# EAGLE design olhos (EAGLE 9.6.2)
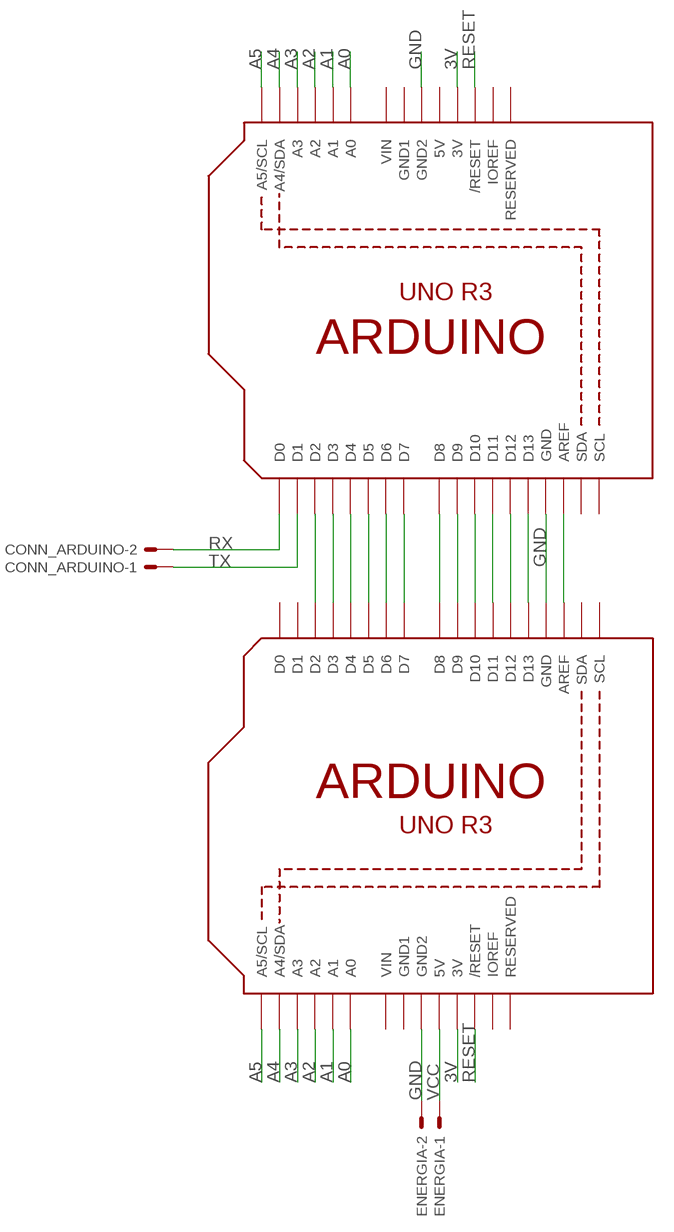
[diagram p0: schematic, sheet 1]

## Parts
CONN_ARDUINO  22-23-2021  [22-23-2021]
ENERGIA  22-23-2021  [22-23-2021]
TELA_LCD  ARDUINOR3-BPLACE  [ARDUINOR3-BPLACE]
U2  ARDUINOR3-BPLACE  [ARDUINOR3-BPLACE]

## Nets
3V [ENERGIA]: TELA_LCD.3V U2.3V
A0: TELA_LCD.A0 U2.A0
A1: TELA_LCD.A1 U2.A1
A2: TELA_LCD.A2 U2.A2
A3: TELA_LCD.A3 U2.A3
A4: TELA_LCD.A4(A4/SDA) U2.A4(A4/SDA)
A5: TELA_LCD.A5(A5/SCL) U2.A5(A5/SCL)
GND [ENERGIA]: ENERGIA.2 TELA_LCD.GND TELA_LCD.GND2 U2.GND U2.GND2
N$1: TELA_LCD.D2 U2.D2
N$2: TELA_LCD.D3 U2.D3
N$3: TELA_LCD.D4 U2.D4
N$4: TELA_LCD.D5 U2.D5
N$5: TELA_LCD.D6 U2.D6
N$6: TELA_LCD.D7 U2.D7
N$7: TELA_LCD.D8 U2.D8
N$8: TELA_LCD.D9 U2.D9
N$9: TELA_LCD.D10 U2.D10
N$10: TELA_LCD.D11 U2.D11
N$11: TELA_LCD.D12 U2.D12
N$12: TELA_LCD.D13 U2.D13
N$14: TELA_LCD.AREF U2.AREF
RESET: TELA_LCD.RESET(/RESET) U2.RESET(/RESET)
RX: CONN_ARDUINO.2 U2.D0
TX: CONN_ARDUINO.1 U2.D1
VCC [ENERGIA]: ENERGIA.1 TELA_LCD.5V
Unconnected: TELA_LCD.D0 TELA_LCD.D1 TELA_LCD.IOREF TELA_LCD.RESERVED TELA_LCD.SCL TELA_LCD.SDA U2.IOREF U2.RESERVED U2.SCL U2.SDA

## Power pins joined to a net without a drawn wire
5V: U2.5V
GND1: TELA_LCD.GND1 U2.GND1
VIN: TELA_LCD.VIN U2.VIN

## Library data of the parts
CONN_ARDUINO ENERGIA = con-molex:22-23-2021: .100" (2.54mm) Center Header - 2 Pin; MF: MOLEX; MPN: 22-23-2021; OC_FARNELL: 1462926; OC_NEWARK: 25C3832
TELA_LCD U2 = adafruit:ARDUINOR3: This is a new object for the new Arduino R3 - with extra pins that you may want to use (such as IOref, and duplicated A4/A5

## Net classes
0 default: width 0.508 mm, clearance 0.5 mm
1 ENERGIA: width 1.016 mm, clearance 0.5 mm

## Board
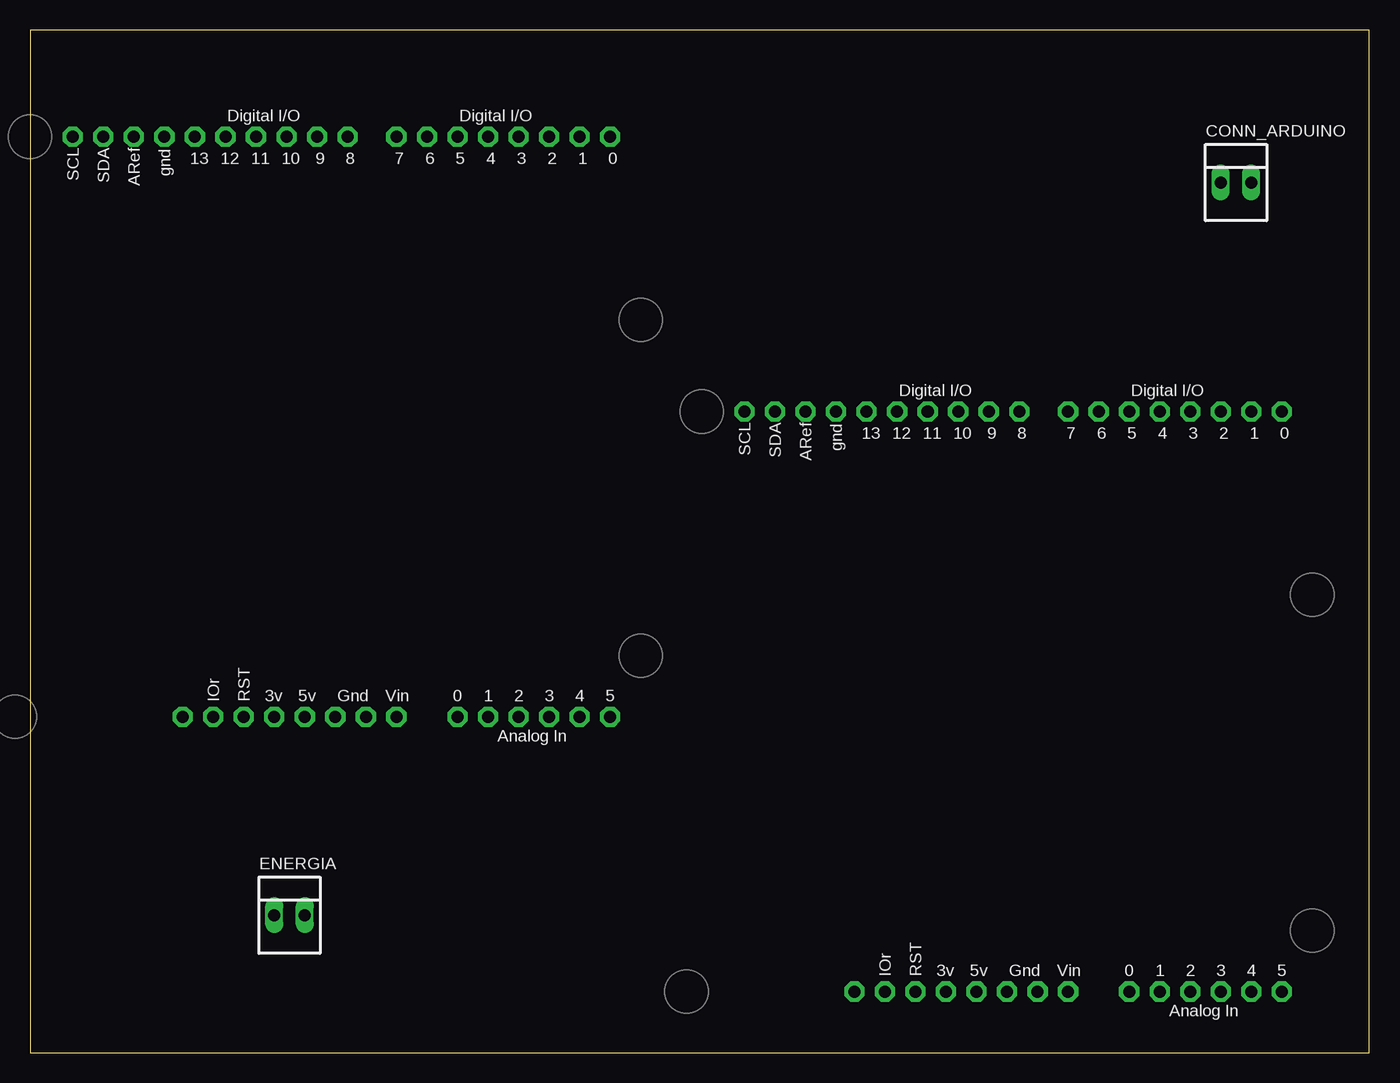
[diagram p1: board, top side]
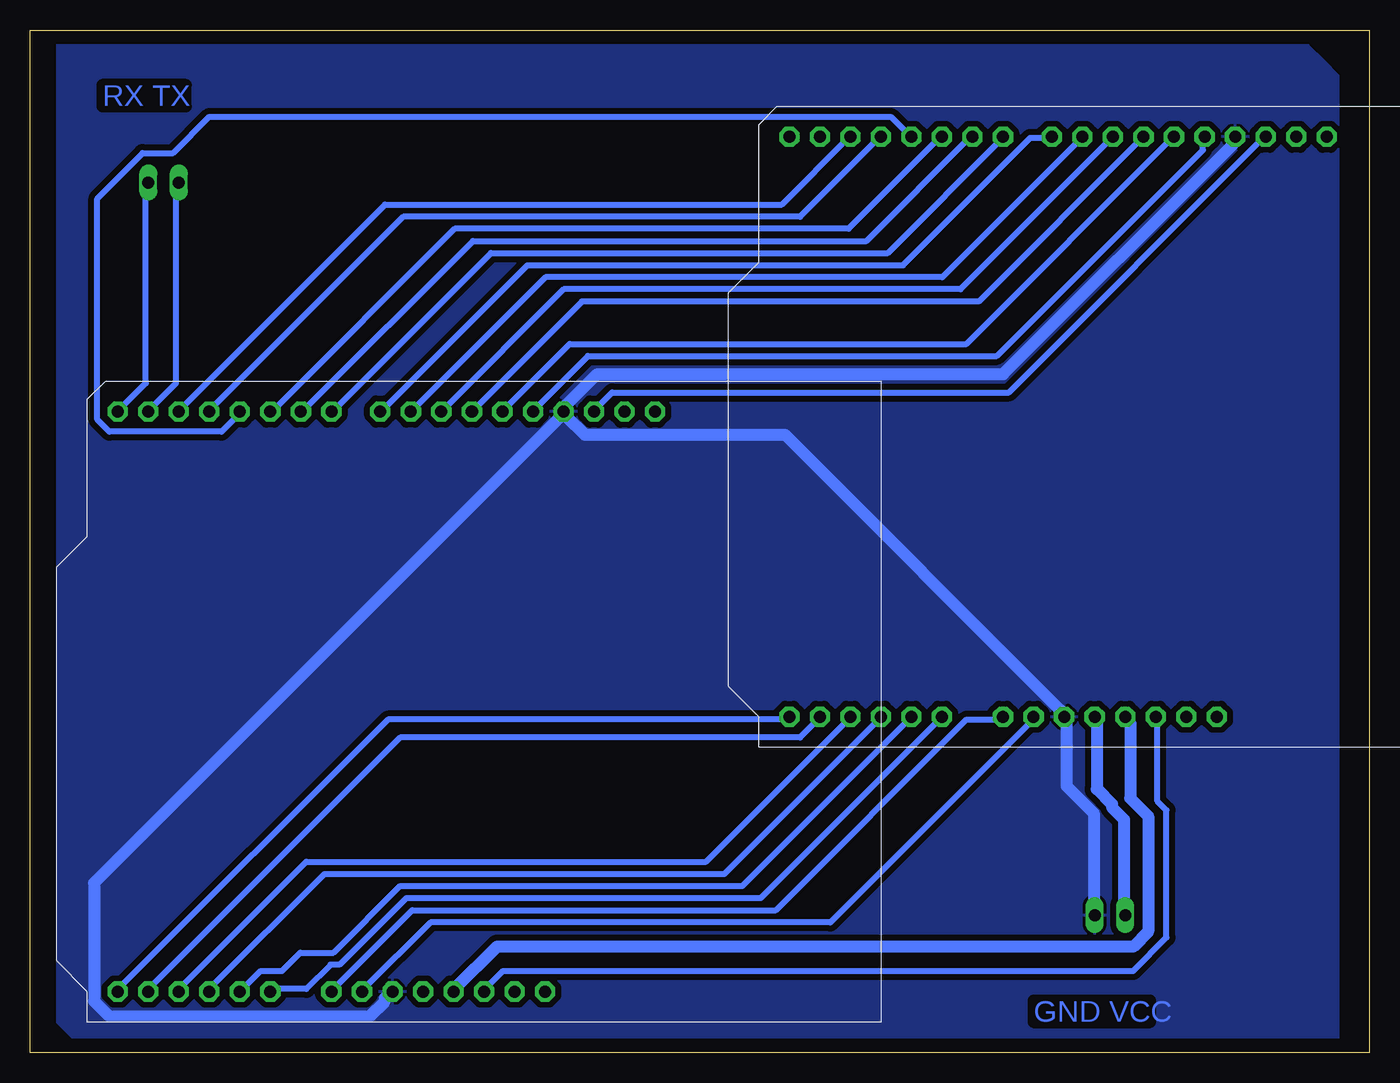
[diagram p2: board, bottom side, seen from below]

Size 111.43 x 85.08 mm. Coordinates in mm from the lower left corner, seen from the top.
Outline: 0,0 111.43,0 111.43,85.08 0,85.08 0,0
Copper layers (1*16): Top 0.035mm / dielectric 1.5mm / Bottom 0.035mm
Design rules "default": minimum track width 6mil, minimum drill 0.35mm, track to track 6mil, track to pad 6mil, pad to pad 6mil, via to via 6mil, smd to smd 6mil, copper to edge 40mil, drill to drill 6mil, minimum pad ring 10mil, minimum via ring 8mil, stop-mask expansion 4mil, vias tented up to drill 0mil, thermal gap 10mil

### Footprints (pad centres in the part's own frame; a part is rotated, then mirrored left to right if it is on the bottom)
22-23-2021 = drill 1 long: 1 -1.27,0; 2 1.27,0
ARDUINOR3-BPLACE = drill 1 pad 1.676 octagon: 3V 35.56,2.54; 5V 38.1,2.54; A0 50.8,2.54; A1 53.34,2.54; A2 55.88,2.54; A3 58.42,2.54; A4 60.96,2.54; A5 63.5,2.54; AREF 23.876,50.8; D0 63.5,50.8; D1 60.96,50.8; D2 58.42,50.8; D3 55.88,50.8; D4 53.34,50.8; D5 50.8,50.8; D6 48.26,50.8; D7 45.72,50.8; D8 41.656,50.8; D9 39.116,50.8; D10 36.576,50.8; D11 34.036,50.8; D12 31.496,50.8; D13 28.956,50.8; GND 26.416,50.8; GND1 43.18,2.54; GND2 40.64,2.54; IOREF 30.48,2.54; RESERVED 27.94,2.54; RESET 33.02,2.54; SCL 18.796,50.8; SDA 21.336,50.8; VIN 45.72,2.54

### Placement (x,y rotation side)
CONN_ARDUINO  100.33,72.39 0 top
ENERGIA  21.59,11.43 0 top
TELA_LCD  -15.24,25.4 0 top
U2  40.64,2.54 0 top

### Tracks (layer width: path | path; a pad name or v marks a point on that pad's centre or on a via)
3V
  Bottom 1.016: U2.3V 76.1,5.29 72.58,8.82 19.66,8.82 18.4,10.08 18.4,19.66 19.91,21.17 19.91,27.47 20.16,27.72 TELA_LCD.3V
A0
  Bottom 0.508: U2.A0 91.22,5.29 88.45,5.29 86.44,7.31 85.68,7.31 80.14,12.85 50.65,12.85 35.78,27.72 TELA_LCD.A0
A1
  Bottom 0.508: TELA_LCD.A1 38.3,27.72 52.16,13.86 80.64,13.86 86.18,8.32 88.96,8.32 90.47,6.8 92.23,6.8 93.74,5.29 U2.A1
A2
  Bottom 0.508: TELA_LCD.A2 40.82,27.72 53.68,14.87 86.94,14.87 96.52,5.29 U2.A2
A3
  Bottom 0.508: TELA_LCD.A3 43.34,27.72 55.19,15.88 88.45,15.88 99.04,5.29 U2.A3
A4
  Bottom 0.508: U2.A4 101.56,5.29 80.64,26.21 47.38,26.21 45.86,27.72 TELA_LCD.A4
A5
  Bottom 0.508: U2.A5 104.08,5.29 81.65,27.72 48.38,27.72 TELA_LCD.A5
GND
  Bottom 1.016: ENERGIA.2 22.93,11.59 22.93,19.91 25.2,22.18 25.2,27.72 TELA_LCD.GND2 25.7,28.22 25.7,28.48 48.64,51.41 65.27,51.41 66.78,52.92 U2.GND | U2.GND2 81.4,5.04 81.9,4.54 81.9,4.28 83.16,3.02 104.83,3.02 106.09,4.28 106.09,14.11 67.03,53.17 U2.GND | TELA_LCD.GND 11.34,76.1 11.34,75.6 30.49,56.45 64.26,56.45 67.03,53.68 U2.GND
  pour Bottom: 2.54,1.27 2.54,81.28 3.81,82.55 5.08,83.82 109.22,83.82 109.22,2.54 107.95,1.27
GND1
  Bottom 0.508: U2.GND1 83.66,5.29 78.12,10.84 44.86,10.84 27.97,27.72 TELA_LCD.GND1
N$1
  Bottom 0.508: TELA_LCD.D2 43.34,76.1 48.89,70.56 81.9,70.56 99.04,53.42 U2.D2
N$2
  Bottom 0.508: U2.D3 96.52,53.42 80.39,69.55 47.38,69.55 40.82,76.1 TELA_LCD.D3
N$3
  Bottom 0.508: TELA_LCD.D4 38.3,76.36 39.82,77.87 96.52,77.87 99.54,74.84 102.06,74.84 105.84,71.06 105.84,52.67 104.83,51.66 95.51,51.66 94,53.17 U2.D4
N$4
  Bottom 0.508: U2.D5 91.22,53.42 76.1,68.54 43.34,68.54 35.78,76.1 TELA_LCD.D5
N$5
  Bottom 0.508: TELA_LCD.D6 33.26,76.1 41.83,67.54 74.59,67.54 88.7,53.42 U2.D6
N$6
  Bottom 0.508: TELA_LCD.D7 30.49,76.1 40.07,66.53 73.08,66.53 86.18,53.42 U2.D7
N$7
  Bottom 0.508: TELA_LCD.D8 26.46,76.1 28.22,76.1 38.81,65.52 70.06,65.52 82.15,53.42 U2.D8
N$8
  Bottom 0.508: U2.D9 79.63,53.42 68.54,64.51 35.53,64.51 23.94,76.1 TELA_LCD.D9
N$9
  Bottom 0.508: U2.D10 77.11,53.42 67.03,63.5 34.02,63.5 21.42,76.1 TELA_LCD.D10
N$10
  Bottom 0.508: U2.D11 65.52,62.5 32.51,62.5 18.9,76.1 TELA_LCD.D11
N$11
  Bottom 0.508: TELA_LCD.D12 16.38,76.1 33.52,58.97 66.53,58.97 72.07,53.42 U2.D12
N$12
  Bottom 0.508: TELA_LCD.D13 13.86,76.1 13.86,75.1 31,57.96 65.02,57.96 69.55,53.42 U2.D13
N$14
  Bottom 0.508: TELA_LCD.AREF 8.82,76.1 29.99,54.94 63,54.94 64.51,53.42 U2.AREF
RESET
  Bottom 0.508: TELA_LCD.RESET 17.64,27.72 17.64,20.92 16.88,20.16 16.88,9.58 19.66,6.8 72.07,6.8 73.58,5.29 U2.RESET
RX
  Bottom 0.508: CONN_ARDUINO.2 101.81,72.32 101.81,55.69 104.08,53.42 U2.D0
TX
  Bottom 0.508: CONN_ARDUINO.1 99.29,72.32 99.29,55.69 101.56,53.42 U2.D1
VCC
  Bottom 1.016: ENERGIA.1 20.41,11.59 20.41,19.4 21.42,20.41 21.42,20.66 22.68,21.92 22.68,27.72 TELA_LCD.5V
VIN
  Bottom 0.508: TELA_LCD.VIN 30.49,27.72 33.52,27.72 49.39,11.84 79.63,11.84 86.18,5.29 U2.VIN

### Text on the board
Bottom: RX TX | GND VCC